# Altium schematic sheet top.SchDoc
size A
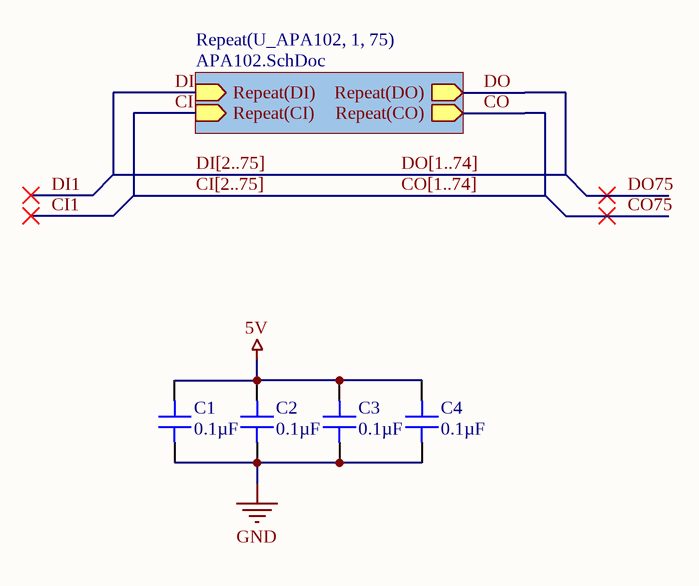
[diagram p0: top.SchDoc]

## Parts
C1  0.1µF  [CAP 0402_1005]
C2  0.1µF  [CAP 0402_1005]
C3  0.1µF  [CAP 0402_1005]
C4  0.1µF  [CAP 0402_1005]

## Sub-sheets
Repeat(U_APA102, 1, 75) = APA102.SchDoc: Repeat(DI) (in), Repeat(CI) (in), Repeat(CO) (out), Repeat(DO) (out)

## Nets
5V: C1.2 C2.2 C3.2 C4.2
GND: C1.1 C2.1 C3.1 C4.1
CI: sheet Repeat(U_APA102, 1, 75)/Repeat(CI)
CO: sheet Repeat(U_APA102, 1, 75)/Repeat(CO)
DI: sheet Repeat(U_APA102, 1, 75)/Repeat(DI)
DO: sheet Repeat(U_APA102, 1, 75)/Repeat(DO)

## Buses and harness runs
bus CI[2..75] = CO[1..74]
bus DI[2..75] = DO[1..74]

## Library data of the parts
C1-C4 = VJ0402V104ZXJCW1BC: CAP CER 0.1UF 16V Y5V 0402; Manufacturer: Vishay Vitramon; Temperature Coefficient: Y5V (F); Tolerance: -20%, +80%; Part Number: VJ0402V104ZXJCW1BC; Value: 0.1µF; Applications: General Purpose; Capacitance: 0.1µF; ComponentLink1Description: Datasheet; ComponentLink1URL: https://www.vishay.com/docs/28548/vjw1bcbascomseries.pdf; ComponentLink2Description: DigiKey Link; ComponentLink2URL: http://digikey.com/product-detail/en/vishay-vitramon/VJ0402V104ZXJCW1BC/720-1523-1-ND/420979; Device Package: 0402 (1005 Metric); LastUpdated: 9/2/2020 1:01:27 AM; Lifecycle Status: Active; Minimum Order: 1; Mounting Type: Surface Mount, MLCC; Operating Temperature: -30°C ~ 85°C; Package / Case: 0402 (1005 Metric); Packaging: TapeAndReel; PartId: 12979; Part Status: Active; Price: 0.01; Series: VJ; Size / Dimension: 0.039" L x 0.020" W (1.00mm x 0.50mm); Supplier 1: DigiKey; Supplier Part Number 1: 720-1523-1-ND; Thickness (Max): 0.022" (0.55mm); Voltage - Rated: 16V